# Altium project AMS.PrjPCB
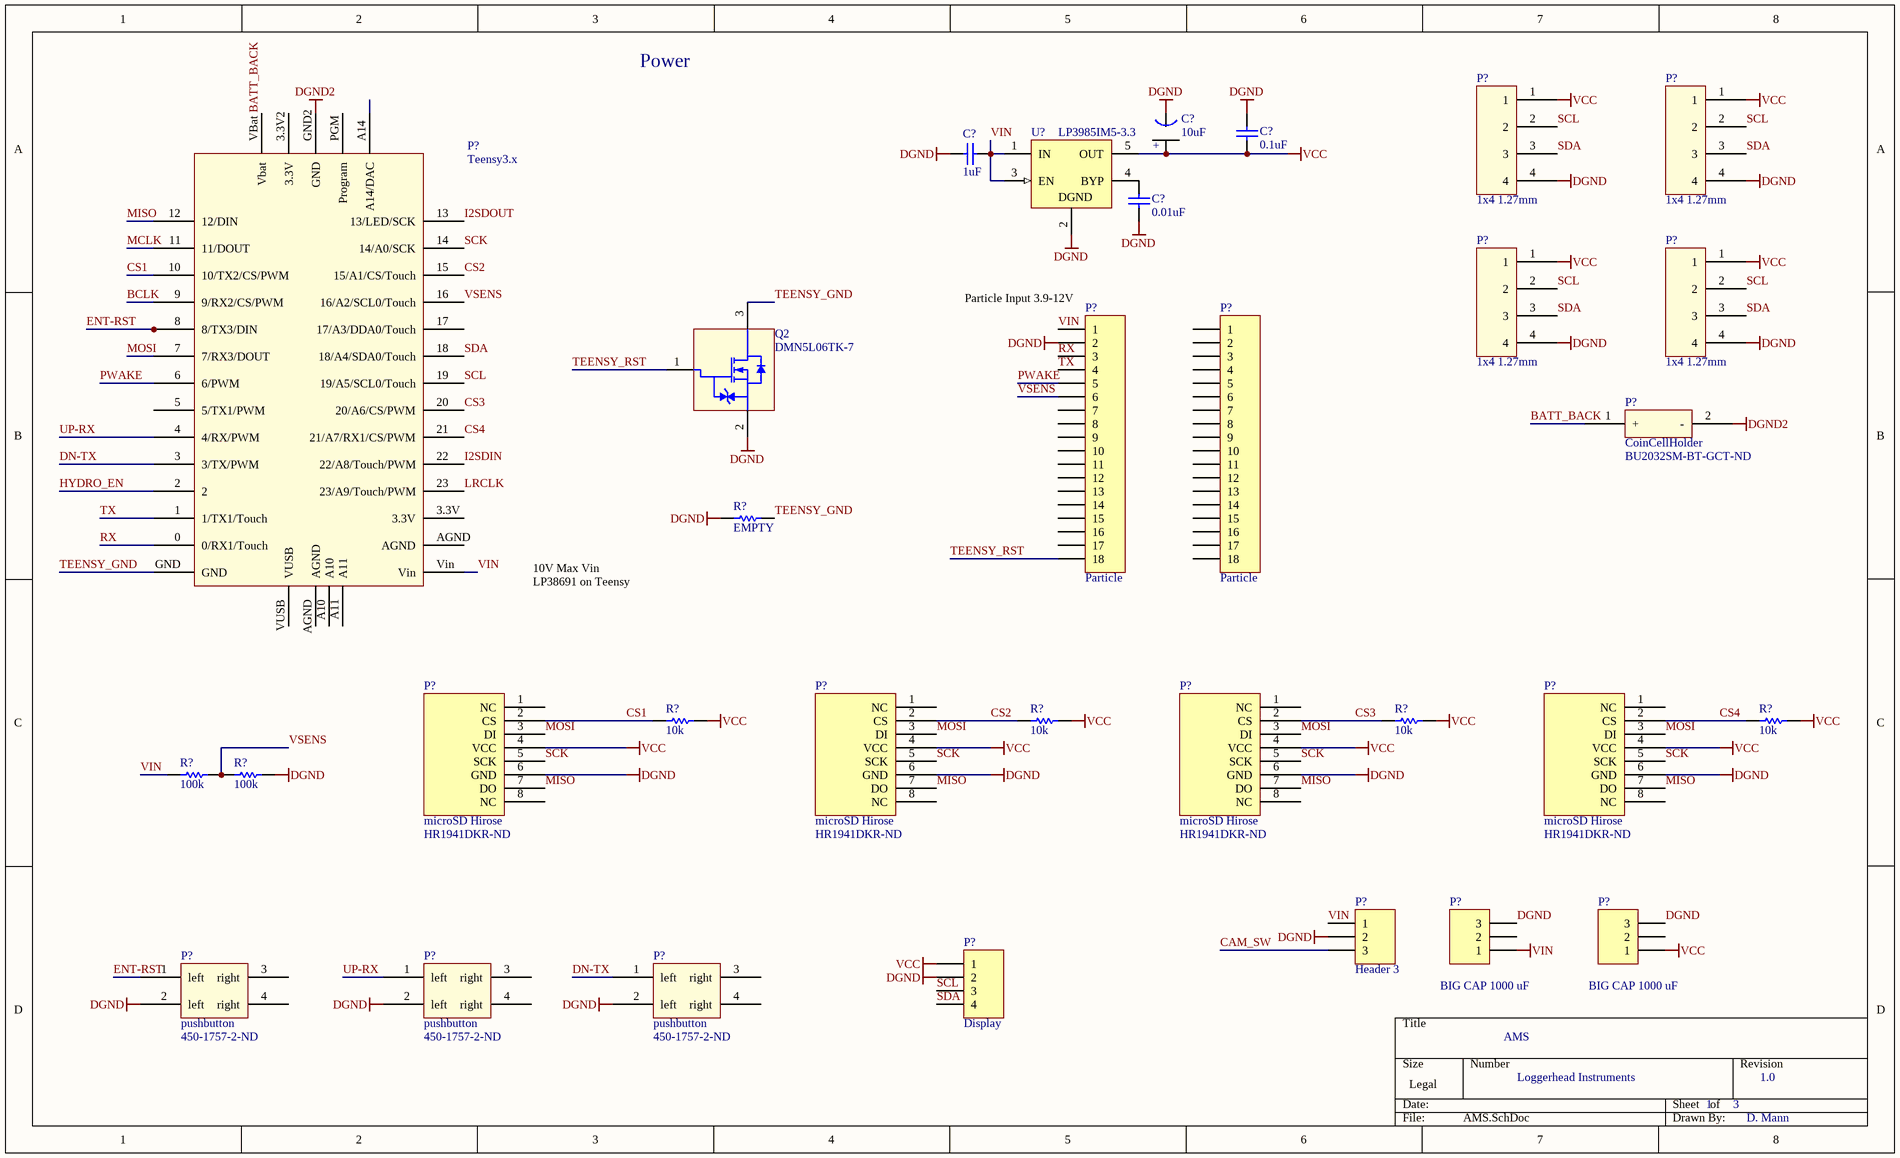
[diagram p0: AMS.SchDoc]
3 sheets, 75 parts. Net scope: global (net labels, ports and power ports of the same name join across sheets).
Sheets:
  AMS.SchDoc
  AMS_Audio.SchDoc
  AMS_Solar.SchDoc

## Sheet AMS.SchDoc
size Legal

### Parts
(Parts that share a designator on the sheet are numbered #1, #2 ... from top to bottom, then left to right.)
C?#1  0.1uF  [0402]
C?#2  10uF  [Tant0805]
C?#3  1uF  [0402]
C?#4  0.01uF  [0402]
P?#1  1x4 1.27mm  [Header1x4 1.27mm]
P?#2  1x4 1.27mm  [Header1x4 1.27mm]
P?#3  1x4 1.27mm  [Header1x4 1.27mm]
P?#4  1x4 1.27mm  [Header1x4 1.27mm]
P?#5  Particle  [HDR1X18]
P?#6  Particle  [HDR1X18]
P?#7  Teensy3.x  [Teensy3.x]
P?#8  CoinCellHolder  Supplier Part Number 1: BU2032SM-BT-GCT-ND  [CoinCellHolder]
P?#9  microSD Hirose  Supplier Part Number 1: HR1941DKR-ND  [DM3D microSD]
P?#10  microSD Hirose  Supplier Part Number 1: HR1941DKR-ND  [DM3D microSD]
P?#11  microSD Hirose  Supplier Part Number 1: HR1941DKR-ND  [DM3D microSD]
P?#12  microSD Hirose  Supplier Part Number 1: HR1941DKR-ND  [DM3D microSD]
P?#13  Header 3  [HDR1X3]
P?#14  Display  [HDR1X4]
P?#15  BIG CAP 1000 uF  [HDR1X3]
P?#16  BIG CAP 1000 uF  [HDR1X3]
P?#17  pushbutton  Supplier Part Number 1: 450-1757-2-ND  [SOP4]
P?#18  pushbutton  Supplier Part Number 1: 450-1757-2-ND  [SOP4]
P?#19  pushbutton  Supplier Part Number 1: 450-1757-2-ND  [SOP4]
Q2  DMN5L06TK-7  [SOT-523]
R?#1  EMPTY  [3-0603]
R?#2  10k  [3-0603]
R?#3  10k  [3-0603]
R?#4  10k  [3-0603]
R?#5  10k  [3-0603]
R?#6  100k  [3-0603]
R?#7  100k  [3-0603]
U?#1  LP3985IM5-3.3  [MF05A_N]

### Nets
DGND: C?#1.2 C?#2.1(GND) C?#3.2 C?#4.2 P?#1.4 P?#2.4 P?#3.4 P?#4.4 P?#5.2 P?#9.6(GND) P?#10.6(GND) P?#11.6(GND) P?#12.6(GND) P?#13.2 P?#14.2 P?#15.3 P?#16.3 P?#17.2(left) P?#18.2(left) P?#19.2(left) Q2.2(S) R?#1.2 R?#7.1 U?#1.2(GND)
DGND2: P?#7.GND2(GND) P?#8.2(-)
VCC: C?#1.1 C?#2.2(+) P?#1.1 P?#2.1 P?#3.1 P?#4.1 P?#9.4(VCC) P?#10.4(VCC) P?#11.4(VCC) P?#12.4(VCC) P?#14.1 P?#16.1 R?#2.1 R?#3.1 R?#4.1 R?#5.1 U?#1.5(OUT)
VIN: C?#3.1 P?#5.1 P?#7.Vin P?#13.1 P?#15.1 R?#6.2 U?#1.1(IN) U?#1.3(EN)
BATT_BACK: P?#7.VBat(Vbat) P?#8.1(+)
BCLK: P?#7.9(9/RX2/CS/PWM)
CAM_SW: P?#13.3
CS1: P?#7.10(10/TX2/CS/PWM) P?#9.2(CS) R?#2.2
CS2: P?#7.15(15/A1/CS/Touch) P?#10.2(CS) R?#3.2
CS3: P?#7.20(20/A6/CS/PWM) P?#11.2(CS) R?#4.2
CS4: P?#7.21(21/A7/RX1/CS/PWM) P?#12.2(CS) R?#5.2
DN-TX: P?#7.3(3/TX/PWM) P?#19.1(left)
ENT-RST: P?#7.8(8/TX3/DIN) P?#17.1(left)
HYDRO_EN: P?#7.2
I2SDIN: P?#7.22(22/A8/Touch/PWM)
I2SDOUT: P?#7.13(13/LED/SCK)
LRCLK: P?#7.23(23/A9/Touch/PWM)
MCLK: P?#7.11(11/DOUT)
MISO: P?#7.12(12/DIN) P?#9.7(DO) P?#10.7(DO) P?#11.7(DO) P?#12.7(DO)
MOSI: P?#7.7(7/RX3/DOUT) P?#9.3(DI) P?#10.3(DI) P?#11.3(DI) P?#12.3(DI)
PWAKE: P?#5.5 P?#7.6(6/PWM)
RX: P?#5.3 P?#7.0(0/RX1/Touch)
SCK: P?#7.14(14/A0/SCK) P?#9.5(SCK) P?#10.5(SCK) P?#11.5(SCK) P?#12.5(SCK)
SCL: P?#1.2 P?#2.2 P?#3.2 P?#4.2 P?#7.19(19/A5/SCL0/Touch) P?#14.3
SDA: P?#1.3 P?#2.3 P?#3.3 P?#4.3 P?#7.18(18/A4/SDA0/Touch) P?#14.4
TEENSY_GND: P?#7.GND Q2.3(D) R?#1.1
TEENSY_RST: P?#5.18 Q2.1(G)
TX: P?#5.4 P?#7.1(1/TX1/Touch)
UP-RX: P?#7.4(4/RX/PWM) P?#18.1(left)
VSENS: P?#5.6 P?#7.16(16/A2/SCL0/Touch) R?#6.1 R?#7.2
NetC?#4_1: C?#4.1 U?#1.4(BYP)

Not connected (* = marked no-connect by the designer): P?#5 7 8 9 10 11 12 13 14 15 16 17; P?#6 1 2 3 4 5 6 7 8 9 10 11 12 13 14 15 16 17 18; P?#7 3.3V 3.3V2(3.3V) 5(5/TX1/PWM) 17(17/A3/DDA0/Touch) A10 A11 A14(A14/DAC) AGND PGM(Program) VUSB; P?#9 1(NC) 8(NC); P?#10 1(NC) 8(NC); P?#11 1(NC) 8(NC); P?#12 1(NC) 8(NC); P?#15 2; P?#16 2; P?#17 3(right) 4(right); P?#18 3(right) 4(right); P?#19 3(right) 4(right)

### Notes on the sheet
- Power
- (near P?#5) Particle Input 3.9-12V
- 10V Max Vin
  LP38691 on Teensy
- AMS
- Loggerhead Instruments
- 1
- 3
- 1.0
- D. Mann
- (in symbol LP3985IM5-3.3) DGND

### Library data of the parts
C?#1 = C0402: Ceramic Chip Capacitor - Standard; Note: Footprint corresponds to dimensions for bulk cassette packaging. This case size has tightened tolerances.; Published: 17-Jul-2002; LatestRevisionDate: 19-Mar-2004; LatestRevisionNote: Silkscreen size reduced.; DatasheetDocument: Mar-2001; PackageDocument: Mar-2001; PackageReference: 0402; Publisher: Altium Limited; Code_JEITA: 0402; Code_IPC: 1005 [0402]; ComponentLink1Description: Manufacturer Link; ComponentLink1URL: http://www.kemet.com/; ComponentLink2Description: Datasheet; ComponentLink2URL: http://www.kemet.com/kemet/web/homepage/kechome.nsf/vapubfilesname/F3102TA.pdf/$file/F3102TA.pdf; Value: 0.1uF
C?#2 = Tant0805: Value: 10uF
C?#3 C?#4 = C0402: Ceramic Chip Capacitor - Standard; Note: Footprint corresponds to dimensions for bulk cassette packaging. This case size has tightened tolerances.; Value: 0.1uF; Published: 17-Jul-2002; LatestRevisionDate: 19-Mar-2004; LatestRevisionNote: Silkscreen size reduced.; DatasheetDocument: Mar-2001; PackageDocument: Mar-2001; PackageReference: 0402; Publisher: Altium Limited; Code_JEITA: 0402; Code_IPC: 1005 [0402]; ComponentLink1Description: Manufacturer Link; ComponentLink1URL: http://www.kemet.com/; ComponentLink2Description: Datasheet; ComponentLink2URL: http://www.kemet.com/kemet/web/homepage/kechome.nsf/vapubfilesname/F3102TA.pdf/$file/F3102TA.pdf
P?#1-P?#4 = Header 1x4 1.27mm
P?#5 P?#6 = Header 18: Header, 18-Pin; LatestRevisionDate: 17-Jul-2002; LatestRevisionNote: Re-released for DXP Platform.; Publisher: Altium Limited
P?#13 P?#15 P?#16 = Header 3: Header, 3-Pin; LatestRevisionDate: 17-Jul-2002; LatestRevisionNote: Re-released for DXP Platform.; Publisher: Altium Limited
P?#14 = Header 4: Header, 4-Pin; LatestRevisionDate: 17-Jul-2002; LatestRevisionNote: Re-released for DXP Platform.; Publisher: Altium Limited
Q2 = FET DMN5L06TK-7: Ultra-low leakage Enhanced MOSFET; Fabrication Tested: NO; Creator and Date: Will Flanery 2010-09-02; Footprint Verified By: *; Schematic Verified By: *; Vendor Info Verified By: *; Supplier 1: Digi-Key; Supplier Part Number 1: DMN5L06TKDICT-ND; HelpURL: http://www.diodes.com/datasheets/ds30926.pdf
R?#1-R?#7 = ERJ3RK: Precision Thick Film Chip Resistor, 10 Ohm to 1M Ohm Range, 1% and 0.5% Tolerance, 0603 Size, 0.063 W; Published: 17-Dec-2003; LatestRevisionDate: 19-Mar-2004; LatestRevisionNote: Silkscreen size reduced.; PackageDocument: Mar-2003; PackageReference: 3-0603; Publisher: Altium Limited; Code_IPC: 1608 [0603]; ComponentLink1Description: Manufacturer Link; ComponentLink1URL: http://www.panasonic.com/industrial/components/resistive_products.htm; ComponentLink2Description: Datasheet; ComponentLink2URL: http://www.panasonic.com/industrial/components/pdf/AOA0000CE2.pdf
U?#1 = LP3985IM5-3.3: Micropower, 150mA Low-Noise Ultra Low-Dropout CMOS Voltage Regulator; Manufacturer: National Semiconductor; CompType: LDO IC; PackageTopMarking: LDQB*XTT; PowerWise: N; Published: 4-Dec-2008; DatasheetVersion: Aug-2005; PackageVersion: revD, Aug-2008; PackageReference: MF05A; Publisher: Altium Limited; PackageDescription: Molded SOT-23, .115 x .063 x .040 in Body, 5 Lead, .0375 in Pitch; PartNumber: LP3985IM5-3.3; RoHS: O; PinCount: 5; DigiKeyPartNumber: LP3985IM5-3.3CT-ND; ComponentLink1Description: LP3985 Datasheet; ComponentLink1URL: http://www.national.com/ds/LP/LP3985.pdf; ComponentLink2Description: LP3985 Web Page; ComponentLink2URL: http://www.national.com/pf/LP/LP3985.html; ComponentLink3Description: MF05A Package Page; ComponentLink3URL: http://www.national.com/packaging/folders/mf05a.html
P?#8 = CoinCellHolder: Supplier 1: Digi-Key
P?#9-P?#12 = microSD Hirose: Supplier 1: Digi-Key
P?#17-P?#19 = pushbutton: Supplier 1: Digi-Key

## Sheet AMS_Audio.SchDoc
size A
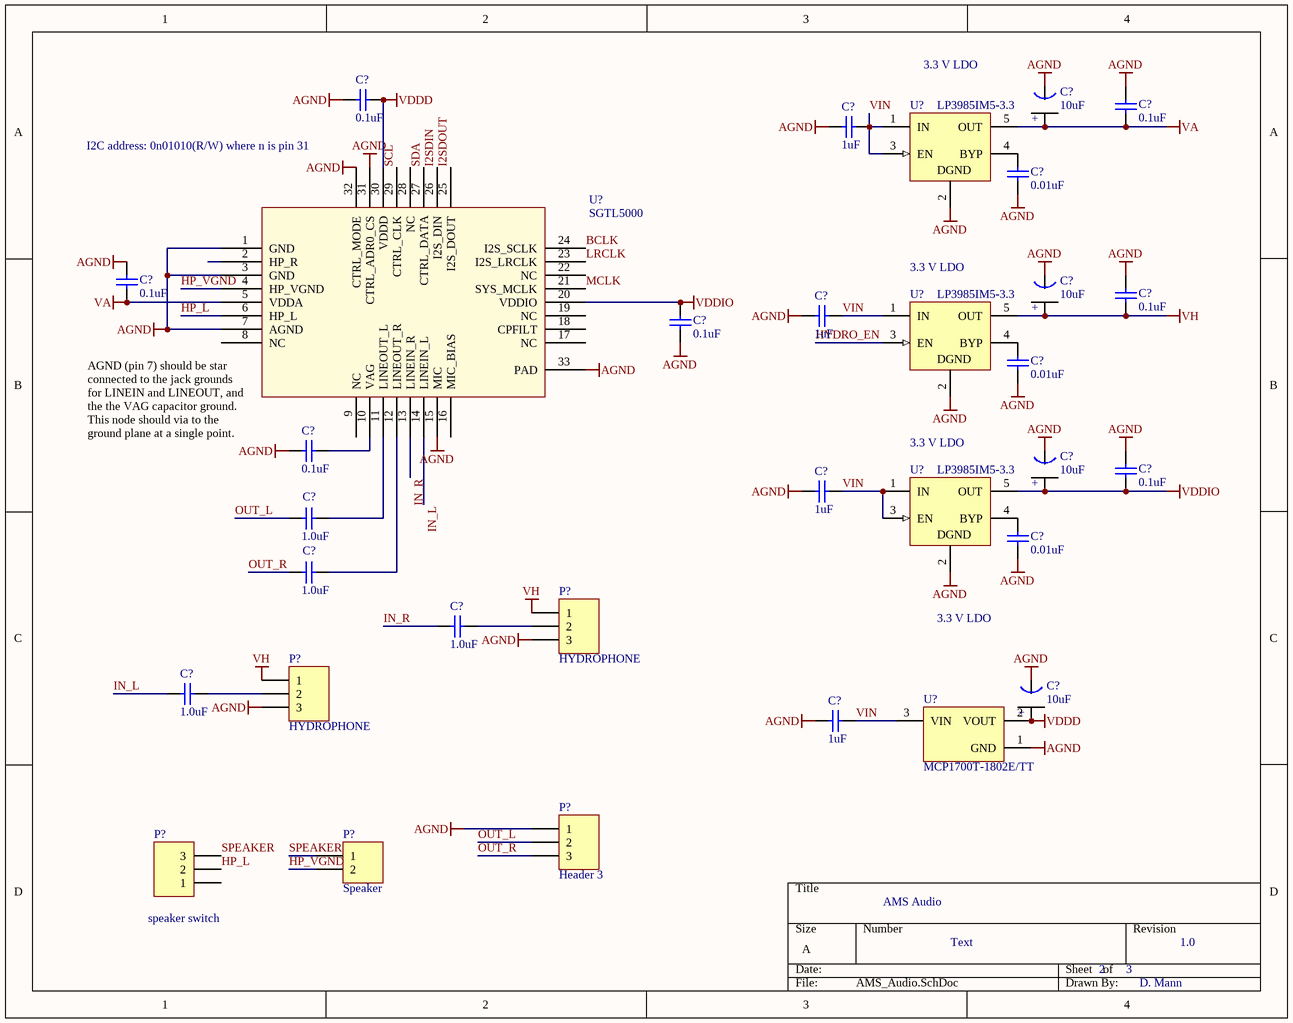
[diagram p1: AMS_Audio.SchDoc]

### Parts
(Parts that share a designator on the sheet are numbered #1, #2 ... from top to bottom, then left to right.)
C?#5  0.1uF  [0402]
C?#6  0.1uF  [0402]
C?#7  10uF  [Tant0805]
C?#8  1uF  [0402]
C?#9  0.01uF  [0402]
C?#10  0.1uF  [0402]
C?#11  0.1uF  [0402]
C?#12  10uF  [Tant0805]
C?#13  0.1uF  [0402]
C?#14  1uF  [0402]
C?#15  0.01uF  [0402]
C?#16  0.1uF  [0402]
C?#17  0.1uF  [0402]
C?#18  10uF  [Tant0805]
C?#19  1.0uF  [0402]
C?#20  1uF  [0402]
C?#21  0.01uF  [0402]
C?#22  1.0uF  [0402]
C?#23  1.0uF  [0402]
C?#24  1.0uF  [0402]
C?#25  10uF  [Tant0805]
C?#26  1uF  [0402]
P?#20  HYDROPHONE  [HDR1X3]
P?#21  HYDROPHONE  [HDR1X3]
P?#22  Header 3  [HDR1X3]
P?#23  Speaker  [HDR1X2]
P?#24  speaker switch  [HDR1X3]
U?#2  LP3985IM5-3.3  [MF05A_N]
U?#3  SGTL5000  [QFN32]
U?#4  LP3985IM5-3.3  [MF05A_N]
U?#5  LP3985IM5-3.3  [MF05A_N]
U?#6  MCP1700T-1802E/TT  [SOT-23-TT3_N]

### Nets
AGND: C?#5.2 C?#6.2 C?#7.1(GND) C?#8.2 C?#9.2 C?#10.2 C?#11.2 C?#12.1(GND) C?#13.2 C?#14.2 C?#15.2 C?#16.2 C?#17.2 C?#18.1(GND) C?#20.2 C?#21.2 C?#25.1(GND) C?#26.2 P?#20.3 P?#21.3 P?#22.1 U?#2.2(GND) U?#3.1(GND) U?#3.3(GND) U?#3.7(AGND) U?#3.15(MIC) U?#3.31(CTRL_ADR0_CS) U?#3.32(CTRL_MODE) U?#3.33(PAD) U?#4.2(GND) U?#5.2(GND) U?#6.1(GND)
VA: C?#6.1 C?#7.2(+) C?#10.1 U?#2.5(OUT) U?#3.5(VDDA)
VDDD: C?#5.1 C?#25.2(+) U?#3.30(VDDD) U?#6.2(VOUT)
VDDIO: C?#13.1 C?#17.1 C?#18.2(+) U?#3.20(VDDIO) U?#5.5(OUT)
VH: C?#11.1 C?#12.2(+) P?#20.1 P?#21.1 U?#4.5(OUT)
VIN: C?#8.1 C?#14.1 C?#20.1 C?#26.1 U?#2.1(IN) U?#2.3(EN) U?#4.1(IN) U?#5.1(IN) U?#5.3(EN) U?#6.3(VIN)
BCLK: U?#3.24(I2S_SCLK)
HP_L: P?#24.2 U?#3.6(HP_L)
HP_VGND: P?#23.2 U?#3.4(HP_VGND)
HYDRO_EN: U?#4.3(EN)
I2SDIN: U?#3.26(I2S_DIN)
I2SDOUT: U?#3.25(I2S_DOUT)
IN_L: C?#24.2 U?#3.14(LINEIN_L)
IN_R: C?#23.2 U?#3.13(LINEIN_R)
LRCLK: U?#3.23(I2S_LRCLK)
MCLK: U?#3.21(SYS_MCLK)
OUT_L: C?#19.1 P?#22.2
OUT_R: C?#22.1 P?#22.3
SCL: U?#3.29(CTRL_CLK)
SDA: U?#3.27(CTRL_DATA)
SPEAKER: P?#23.1 P?#24.3
NetC?#9_1: C?#9.1 U?#2.4(BYP)
NetC?#15_1: C?#15.1 U?#4.4(BYP)
NetC?#16_1: C?#16.1 U?#3.10(VAG)
NetC?#19_2: C?#19.2 U?#3.11(LINEOUT_L)
NetC?#21_1: C?#21.1 U?#5.4(BYP)
NetC?#22_2: C?#22.2 U?#3.12(LINEOUT_R)
NetC?#23_1: C?#23.1 P?#20.2
NetC?#24_1: C?#24.1 P?#21.2

Not connected (* = marked no-connect by the designer): P?#24 1; U?#3 2(HP_R) 8(NC) 9(NC) 16(MIC_BIAS) 17(NC) 18(CPFILT) 19(NC) 22(NC) 28(NC)

### Notes on the sheet
- 3.3 V LDO
- I2C address: 0n01010(R/W) where n is pin 31
- (near U?#4) 3.3 V LDO
- (near U?#3) AGND (pin 7) should be star connected to the jack grounds for LINEIN and LINEOUT, and the the VAG capacitor ground. This node should via to the ground plane at a single point.
- (near U?#5) 3.3 V LDO
- AMS Audio
- Text
- 2
- 3
- 1.0
- D. Mann
- (in symbol LP3985IM5-3.3) DGND

### Library data of the parts
C?#5 C?#6 C?#10 C?#11 C?#13 C?#16 C?#17 = C0402: as C?#1 on sheet AMS; Published: 17-Jul-2002; LatestRevisionDate: 19-Mar-2004; LatestRevisionNote: Silkscreen size reduced.; DatasheetDocument: Mar-2001; PackageDocument: Mar-2001; PackageReference: 0402; Publisher: Altium Limited; Code_JEITA: 0402; Code_IPC: 1005 [0402]; ComponentLink1Description: Manufacturer Link; ComponentLink1URL: http://www.kemet.com/; ComponentLink2Description: Datasheet; ComponentLink2URL: http://www.kemet.com/kemet/web/homepage/kechome.nsf/vapubfilesname/F3102TA.pdf/$file/F3102TA.pdf; Value: 0.1uF
C?#7 C?#12 C?#18 C?#25 = Tant0805: Value: 10uF
C?#8 C?#9 C?#14 C?#15 C?#19-C?#24 C?#26 = C0402: as C?#3 on sheet AMS; Published: 17-Jul-2002; LatestRevisionDate: 19-Mar-2004; LatestRevisionNote: Silkscreen size reduced.; DatasheetDocument: Mar-2001; PackageDocument: Mar-2001; PackageReference: 0402; Publisher: Altium Limited; Code_JEITA: 0402; Code_IPC: 1005 [0402]; ComponentLink1Description: Manufacturer Link; ComponentLink1URL: http://www.kemet.com/; ComponentLink2Description: Datasheet; ComponentLink2URL: http://www.kemet.com/kemet/web/homepage/kechome.nsf/vapubfilesname/F3102TA.pdf/$file/F3102TA.pdf
P?#20-P?#22 P?#24 = Header 3: Header, 3-Pin; LatestRevisionDate: 17-Jul-2002; LatestRevisionNote: Re-released for DXP Platform.; Publisher: Altium Limited
P?#23 = Header 2: Header, 2-Pin; LatestRevisionDate: 17-Jul-2002; LatestRevisionNote: Re-released for DXP Platform.; Publisher: Altium Limited
U?#2 U?#4 U?#5 = LP3985IM5-3.3: as U?#1 on sheet AMS; Published: 4-Dec-2008; DatasheetVersion: Aug-2005; PackageVersion: revD, Aug-2008; PackageReference: MF05A; Publisher: Altium Limited; PackageDescription: Molded SOT-23, .115 x .063 x .040 in Body, 5 Lead, .0375 in Pitch; PartNumber: LP3985IM5-3.3; RoHS: O; PinCount: 5; DigiKeyPartNumber: LP3985IM5-3.3CT-ND; ComponentLink1Description: LP3985 Datasheet; ComponentLink1URL: http://www.national.com/ds/LP/LP3985.pdf; ComponentLink2Description: LP3985 Web Page; ComponentLink2URL: http://www.national.com/pf/LP/LP3985.html; ComponentLink3Description: MF05A Package Page; ComponentLink3URL: http://www.national.com/packaging/folders/mf05a.html
U?#6 = MCP1700T-1802E/TT: Low Quiescent Current LDO, 3-Pin SOT-23, Extended Temperature, Tape and Reel; Manufacturer: Microchip; DatasheetVersion: revB, Feb-2007; PackageVersion: revBB, Aug-2009; PackageReference: SOT-23-TT3; PackageDescription: 3-Lead Plastic Small Outline Transistor (TT) [SOT-23]; Supplier 1: Digi-Key; Supplier Part Number 1: MCP1700T1802ETTTR-ND; Supplier 2: Digi-Key; Supplier Part Number 2: MCP1700T1802ETTCT-ND; Supplier 3: Digi-Key; Supplier Part Number 3: MCP1700T1802ETTDKR-ND; Supplier 4: Farnell; Supplier Part Number 4: 1296591RL; Supplier 5: Farnell; Supplier Part Number 5: 1296591; Supplier 6: Newark; Supplier Part Number 6: 84R5175; Supplier 7: Mouser; Supplier Part Number 7: 579-MCP1700T1802E/TT; Mounting Technology: Surface Mount; Code_IPC: SOT23-3; PartNumber: MCP1700T-1802E/TT; ComponentLink1Description: Manufacturer URL; ComponentLink1URL: http://www.microchip.com/; ComponentLink2Description: Datasheet; ComponentLink2URL: http://ww1.microchip.com/downloads/en/DeviceDoc/21826b.pdf; ComponentLink3Description: Package Specification; ComponentLink3URL: http://www.microchip.com/stellent/groups/techpub_sg/documents/packagingspec/en012702.pdf

## Sheet AMS_Solar.SchDoc
size A
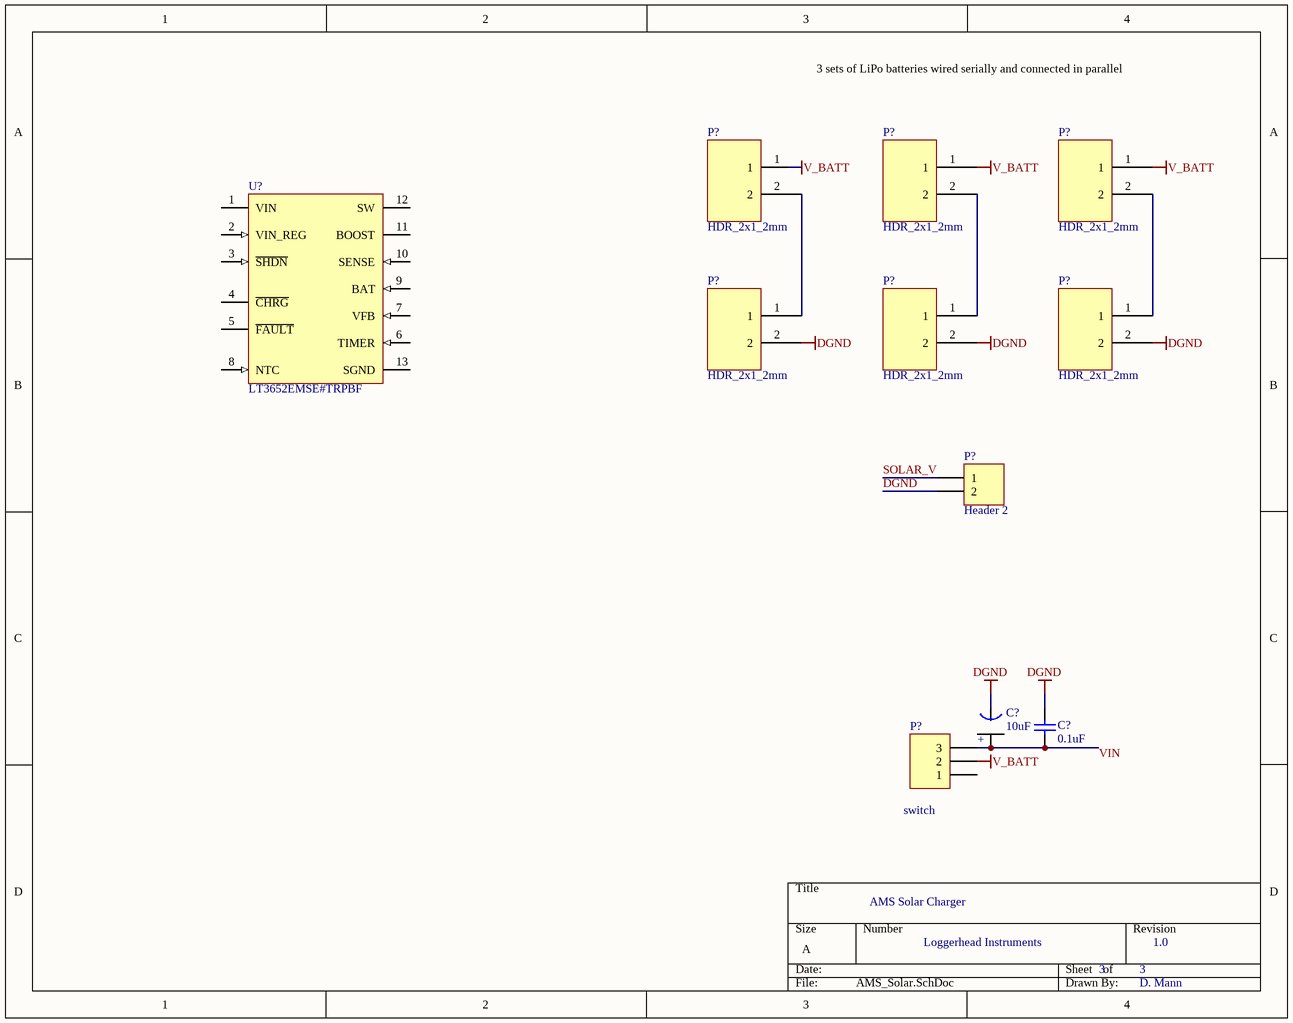
[diagram p2: AMS_Solar.SchDoc]

### Parts
(Parts that share a designator on the sheet are numbered #1, #2 ... from top to bottom, then left to right.)
C?#27  0.1uF  [0402]
C?#28  10uF  [Tant0805]
P?#25  HDR_2x1_2mm  [HDR_2x1_2mm]
P?#26  HDR_2x1_2mm  [HDR_2x1_2mm]
P?#27  HDR_2x1_2mm  [HDR_2x1_2mm]
P?#28  HDR_2x1_2mm  [HDR_2x1_2mm]
P?#29  HDR_2x1_2mm  [HDR_2x1_2mm]
P?#30  HDR_2x1_2mm  [HDR_2x1_2mm]
P?#31  Header 2  [HDR1X2]
P?#32  switch  [HDR1X3]
U?#7  LT3652EMSE#TRPBF  [LT-MSE-12-EDP_N]

### Nets
DGND: C?#27.2 C?#28.1(GND) P?#28.2 P?#29.2 P?#30.2 P?#31.2
V_BATT: P?#25.1 P?#26.1 P?#27.1 P?#32.2
SOLAR_V: P?#31.1
NetC?#27_1: C?#27.1 C?#28.2(+) P?#32.3
NetP?#25_2: P?#25.2 P?#28.1
NetP?#26_2: P?#26.2 P?#29.1
NetP?#27_2: P?#27.2 P?#30.1

Not connected (* = marked no-connect by the designer): P?#32 1; U?#7 1(VIN) 2(VIN_REG) 3(~{SHDN}) 4(~{CHRG}) 5(~{FAULT}) 6(TIMER) 7(VFB) 8(NTC) 9(BAT) 10(SENSE) 11(BOOST) 12(SW) 13(SGND)

### Notes on the sheet
- 3 sets of LiPo batteries wired serially and connected in parallel
- AMS Solar Charger
- Loggerhead Instruments
- 3
- 1.0
- D. Mann
- Labels drawn without touching a wire or pin: VIN

### Library data of the parts
C?#27 = C0402: as C?#1 on sheet AMS; Published: 17-Jul-2002; LatestRevisionDate: 19-Mar-2004; LatestRevisionNote: Silkscreen size reduced.; DatasheetDocument: Mar-2001; PackageDocument: Mar-2001; PackageReference: 0402; Publisher: Altium Limited; Code_JEITA: 0402; Code_IPC: 1005 [0402]; ComponentLink1Description: Manufacturer Link; ComponentLink1URL: http://www.kemet.com/; ComponentLink2Description: Datasheet; ComponentLink2URL: http://www.kemet.com/kemet/web/homepage/kechome.nsf/vapubfilesname/F3102TA.pdf/$file/F3102TA.pdf; Value: 0.1uF
C?#28 = Tant0805: Value: 10uF
P?#31 = Header 2: Header, 2-Pin; LatestRevisionDate: 17-Jul-2002; LatestRevisionNote: Re-released for DXP Platform.; Publisher: Altium Limited
P?#32 = Header 3: Header, 3-Pin; LatestRevisionDate: 17-Jul-2002; LatestRevisionNote: Re-released for DXP Platform.; Publisher: Altium Limited
U?#7 = LT3652EMSE#TRPBF: Power Tracking 2 A Battery Charger for Solar Power, 12-pin SOP (MSE-12-EDP), -40 to 125 degC, Pb-Free, Tape and Reel; Manufacturer: Linear Technology; Number of Outputs: 1; Vin Max(V): 32; Vin Min(V): 4.95; DatasheetVersion: Rev. D; PackageVersion: Rev. G, 05/2013; PackageReference: MSE-12-EDP; PackageDescription: 12-Pin Plastic MSOP, Exposed Die Pad, Body 4.039 x 3 mm, Pitch 0.65 mm; Supplier 1: Digi-Key; Supplier Part Number 1: LT3652EMSE#TRPBF-ND; Supplier 2: Newark; Supplier Part Number 2: 64R8540; Energy Source: Solar; Packing: Tape and Reel; RoHS: TRUE; Topology: Battery Charger; Mounting Technology: Surface Mount; PartNumber: LT3652EMSE#TRPBF; ComponentLink1Description: Manufacturer URL; ComponentLink1URL: http://www.linear.com/; ComponentLink2Description: Datasheet; ComponentLink2URL: http://cds.linear.com/docs/en/datasheet/3652fd.pdf; ComponentLink3Description: Package Specification; ComponentLink3URL: http://cds.linear.com/docs/en/packaging/05081666_G_MSE12.pdf

## Nets that join several sheets
DGND: AMS (24 pins), AMS_Solar (6 pins)
VIN: AMS (8 pins), AMS_Audio (10 pins)
BCLK: AMS (P?#7.9), AMS_Audio (U?#3.24)
HYDRO_EN: AMS (P?#7.2), AMS_Audio (U?#4.3)
I2SDIN: AMS (P?#7.22), AMS_Audio (U?#3.26)
I2SDOUT: AMS (P?#7.13), AMS_Audio (U?#3.25)
LRCLK: AMS (P?#7.23), AMS_Audio (U?#3.23)
MCLK: AMS (P?#7.11), AMS_Audio (U?#3.21)
SCL: AMS (6 pins), AMS_Audio (U?#3.29)
SDA: AMS (6 pins), AMS_Audio (U?#3.27)